# Altium project Flight Controller.PrjPcb (part 2 of 2)
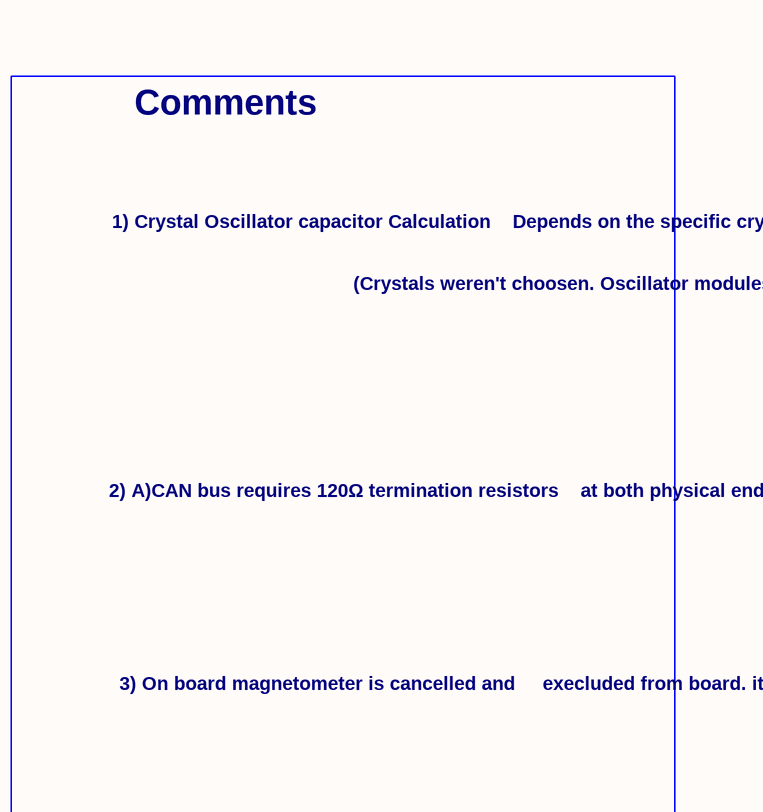
[diagram p12: Sensors.SchDoc, right]

## Nets that join several sheets
+3.3V: power (C19.1 R14.2 U5.5), MCU (20 pins), connectors (5 pins), Sensors (23 pins)
+3V3_Sensors: power (#FLG010.1 C20.1 U6.5), Sensors (9 pins)
+pwr_out: power (5 pins), connectors (J8.1 J9.1 TP6.1)
+VBAT: power (D1.1 Q1.3), MCU (R7.2), connectors (#FLG011.1 J6.1 TP14.1)
FB_5V: power (16 pins), connectors (8 pins), Sensors (7 pins)
GND: power (37 pins), MCU (27 pins), connectors (24 pins), Sensors (42 pins)
BMP_INT: MCU (U7.35), Sensors (U12.7)
CAN_N: connectors (J10.2), Sensors (D8.1 R28.2 U14.6)
CAN_P: connectors (J10.3), Sensors (D8.2 R28.1 U14.7)
CURR: MCU (U7.18), connectors (J6.4)
DJI_RX: MCU (U7.37), connectors (J9.4)
DJI_SBUS: MCU (U7.23), connectors (J9.6)
DJI_TX: MCU (U7.38), connectors (J9.3)
EXPANSION_RX: MCU (U7.54), connectors (J11.2)
EXPANSION_TX: MCU (U7.53), connectors (J11.3)
FDCAN_RX: MCU (U7.81), Sensors (U14.4)
FDCAN_TX: MCU (U7.82), Sensors (U14.1)
FLASH_CS: MCU (U7.28), Sensors (R22.1 U9.1)
FLASH_MISO: MCU (U7.30), Sensors (U9.2)
FLASH_MOSI: MCU (U7.31), Sensors (U9.5)
FLASH_SCLK: MCU (U7.29), Sensors (U9.6)
GPS_RX: MCU (U7.97), connectors (J4.3 TP36.1)
GPS_SCL: MCU (U7.92), connectors (J4.5 TP37.1), Sensors (R31.2)
GPS_SDA: MCU (U7.93), connectors (J4.4 TP38.1), Sensors (R32.2)
GPS_TX: MCU (U7.98), connectors (J4.2 TP35.1)
I2C1_SCL: MCU (U7.95), connectors (J5.3 TP41.1), Sensors (R23.2 U11.1)
I2C1_SDA: MCU (U7.96), connectors (J5.2 TP42.1), Sensors (R24.2 U11.11)
I2C2_SCL: MCU (U7.46), connectors (TP39.1), Sensors (R30.1 U12.2)
I2C2_SDA: MCU (U7.47), connectors (TP40.1), Sensors (R29.1 U12.4)
IMU2_CS: MCU (U7.88), Sensors (U8.12)
IMU2_INT1: MCU (U7.3), Sensors (U8.4)
IMU2_MISO: MCU (U7.90), Sensors (U8.1)
IMU2_MOSI: MCU (U7.91), Sensors (U8.14)
IMU2_SCLK: MCU (U7.89), Sensors (U8.13)
IMU_CS: MCU (U7.84), Sensors (U10.12)
IMU_INT1: MCU (U7.83), Sensors (U10.4)
IMU_MISO: MCU (U7.79), Sensors (U10.1)
IMU_MOSI: MCU (U7.80), Sensors (U10.14)
IMU_SCLK: MCU (U7.78), Sensors (U10.13)
M1: MCU (U7.63), connectors (TP2.1)
M2: MCU (U7.64), connectors (TP5.1)
M3: MCU (U7.65), connectors (TP8.1)
M4: MCU (U7.66), connectors (TP15.1)
M5: MCU (U7.39), connectors (J6.8)
M6: MCU (U7.41), connectors (J6.7)
M7: MCU (U7.43), connectors (J6.6)
M8: MCU (U7.44), connectors (J6.5)
OSD_CS: MCU (U7.7), Sensors (U13.8)
OSD_MISO: MCU (U7.4), Sensors (U13.11)
OSD_MOSI: MCU (U7.5), Sensors (U13.9)
OSD_SCLK: MCU (U7.1), Sensors (U13.10)
S1: MCU (U7.59), connectors (TP13.1)
S2: MCU (U7.60), connectors (TP16.1)
S3: MCU (U7.61), connectors (TP20.1)
S4: MCU (U7.62), connectors (TP24.1)
ST_SWCLK: MCU (U7.76), connectors (J3.3)
ST_SWDIO: MCU (U7.72), connectors (J3.2)
TELEMETRY_RX: MCU (U7.51), connectors (TP29.1)
TELEMETRY_TX: MCU (U7.52), connectors (TP30.1)
USB_DN: power (U2.6), MCU (U7.70)
USB_DP: power (U2.4), MCU (U7.71)
VIDEO_IN: connectors (J2.2 TP28.1), Sensors (C51.2 R25.1)
VIDEO_OUT: connectors (J8.2 TP34.1), Sensors (R26.1)
VTX_TX: MCU (U7.24), connectors (J8.3 TP33.1)
WIFI/RC_RX: MCU (U7.56), connectors (J7.2)
WIFI/RC_TX: MCU (U7.55), connectors (J7.3)